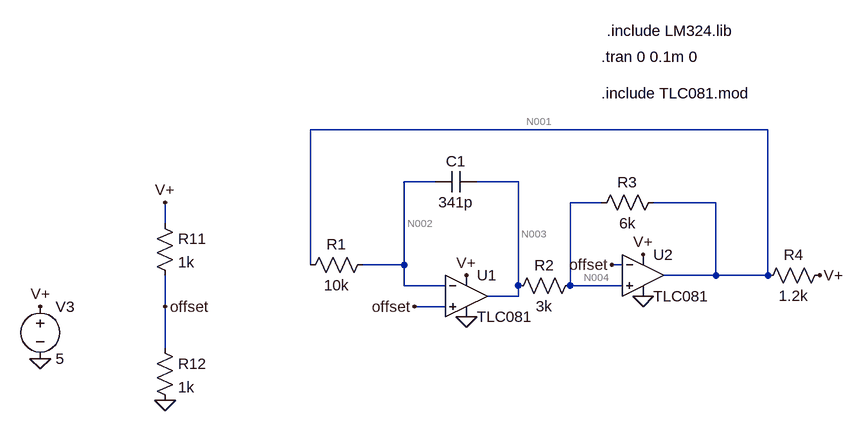
[diagram p0: schematic Zoe_Phase2.asc]
Zoe_Phase2.asc, the LTspice schematic file:
Version 4
SHEET 1 960 852
WIRE 592 384 -112 384
WIRE 80 464 32 464
WIRE 208 464 144 464
WIRE 336 496 288 496
WIRE 512 496 416 496
WIRE -336 528 -336 496
WIRE -112 592 -112 384
WIRE 32 592 32 464
WIRE 32 592 -32 592
WIRE 368 592 352 592
WIRE 512 608 512 496
WIRE 512 608 432 608
WIRE 592 608 592 384
WIRE 592 608 512 608
WIRE 32 624 32 592
WIRE 96 624 32 624
WIRE 208 624 208 464
WIRE 288 624 288 496
WIRE 368 624 288 624
WIRE 208 640 208 624
WIRE 208 640 160 640
WIRE -336 656 -336 608
WIRE 96 656 48 656
WIRE -336 720 -336 656
FLAG -528 736 0
FLAG -528 656 V+
FLAG -336 800 0
FLAG -336 496 V+
FLAG 128 608 V+
FLAG 400 576 V+
FLAG 400 640 0
FLAG 128 672 0
FLAG -336 656 offset
FLAG 48 656 offset
FLAG 352 592 offset
FLAG 672 608 V+
SYMBOL cap 144 448 R90
WINDOW 0 0 32 VBottom 2
WINDOW 3 32 32 VTop 2
SYMATTR InstName C1
SYMATTR Value 341p
SYMBOL res 304 608 R90
WINDOW 0 0 56 VBottom 2
WINDOW 3 32 56 VTop 2
SYMATTR InstName R2
SYMATTR Value 3k
SYMBOL res 432 480 R90
WINDOW 0 0 56 VBottom 2
WINDOW 3 32 56 VTop 2
SYMATTR InstName R3
SYMATTR Value 6k
SYMBOL res -16 576 R90
WINDOW 0 0 56 VBottom 2
WINDOW 3 32 56 VTop 2
SYMATTR InstName R1
SYMATTR Value 10k
SYMBOL voltage -528 640 R0
WINDOW 123 0 0 Left 0
WINDOW 39 0 0 Left 0
SYMATTR InstName V3
SYMATTR Value 5
SYMBOL OpAmps\\opamp2 128 576 R0
SYMATTR InstName U1
SYMATTR Value TLC081
SYMBOL OpAmps\\opamp2 400 544 R0
SYMATTR InstName U2
SYMATTR Value TLC081
SYMBOL res -352 512 R0
SYMATTR InstName R11
SYMATTR Value 1k
SYMBOL res -352 704 R0
SYMATTR InstName R12
SYMATTR Value 1k
SYMBOL res 688 592 R90
WINDOW 0 0 56 VBottom 2
WINDOW 3 32 56 VTop 2
SYMATTR InstName R4
SYMATTR Value 1.2k
TEXT 344 232 Left 2 !.include LM324.lib
TEXT 336 272 Left 2 !.tran 0 0.1m 0
TEXT 336 328 Left 2 !.include TLC081.mod

The netlist it stands for:
* Zoe_Phase2.asc
C1 N003 N002 341p
R2 N004 N003 3k
R3 N001 N004 6k
R1 N002 N001 10k
V3 V+ 0 5
XU1 offset N002 V+ 0 N003 TLC081  ; pins In+ In- V+ V- OUT
XU2 N004 offset V+ 0 N001 TLC081  ; pins In+ In- V+ V- OUT
R11 V+ offset 1k
R12 offset 0 1k
R4 V+ N001 1.2k
.include LM324.lib
.tran 0 0.1m 0
.include TLC081.mod
.backanno
.end

* Results of the author's LTspice run, read from the files saved beside the schematic
* Operating Point, zero values left out:
*   V(n003) = 2.499 V
*   V(n002) = 2.501 V
*   V(n004) = 2.499 V
*   V(n001) = 2.501 V
*   V(v+) = 5 V
*   V(offset) = 2.5 V
*   I(R2) = 219.2 nA
*   I(R3) = 219.2 nA
*   I(R1) = -3.133 pA
*   I(R11) = 2.5 mA
*   I(R12) = 2.5 mA
*   I(R4) = 2.083 mA
*   I(V3) = -6.494 mA
*   Ix(u1:1) = 3.131 pA
*   Ix(u1:2) = 3.133 pA
*   Ix(u1:3) = 955.7 µA
*   Ix(u1:4) = -956.2 µA
*   Ix(u1:5) = 219.2 nA
*   Ix(u2:1) = 3.13 pA
*   Ix(u2:2) = 3.132 pA
*   Ix(u2:3) = 955.7 µA
*   Ix(u2:4) = -956.2 µA
*   Ix(u2:5) = 2.083 mA
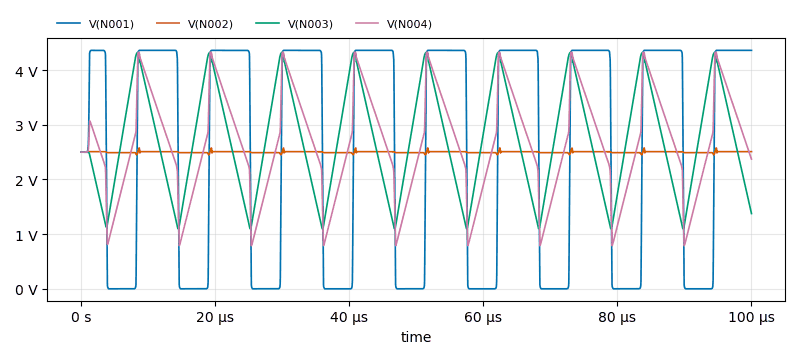
[diagram p1: Transient Analysis of Zoe_Phase2.asc, plotted from the saved traces]
* Transient Analysis, 1 run:
*   V(N001): min 224 µV, max 4.36 V, average 2.539 V, rms 3.294 V, last 4.36 V
*   V(N002): min 2.451 V, max 2.576 V, average 2.501 V, rms 2.501 V, last 2.508 V
*   V(N003): min 1.096 V, max 4.325 V, average 2.712 V, rms 2.99 V, last 1.376 V
*   V(N004): min 789.1 mV, max 4.327 V, average 2.655 V, rms 2.87 V, last 2.371 V